# Altium schematic sheet IPMC_MACP 4.SchDoc: IPMC Driver
size A2; DrawnBy: YYH; Revision: 1.0; PageSetup: Record=PageOptions|CenterHorizontal=True|CenterVertical=True|PrintScale=0.52|XCorrection=1.00|YCorrection=1.00|PrintKind=0|BorderSize=5000000|LeftOffset=0|BottomOffset=0|Orientation=2|PaperLength=1000|PaperWidth=1000|Scale=100|PaperSource=7|PrintQuality=-3|MediaType=1|DitherType=10|PrintScaleMode=1|PaperKind=A4 210 x 297 毫米¦PaperIndex=9
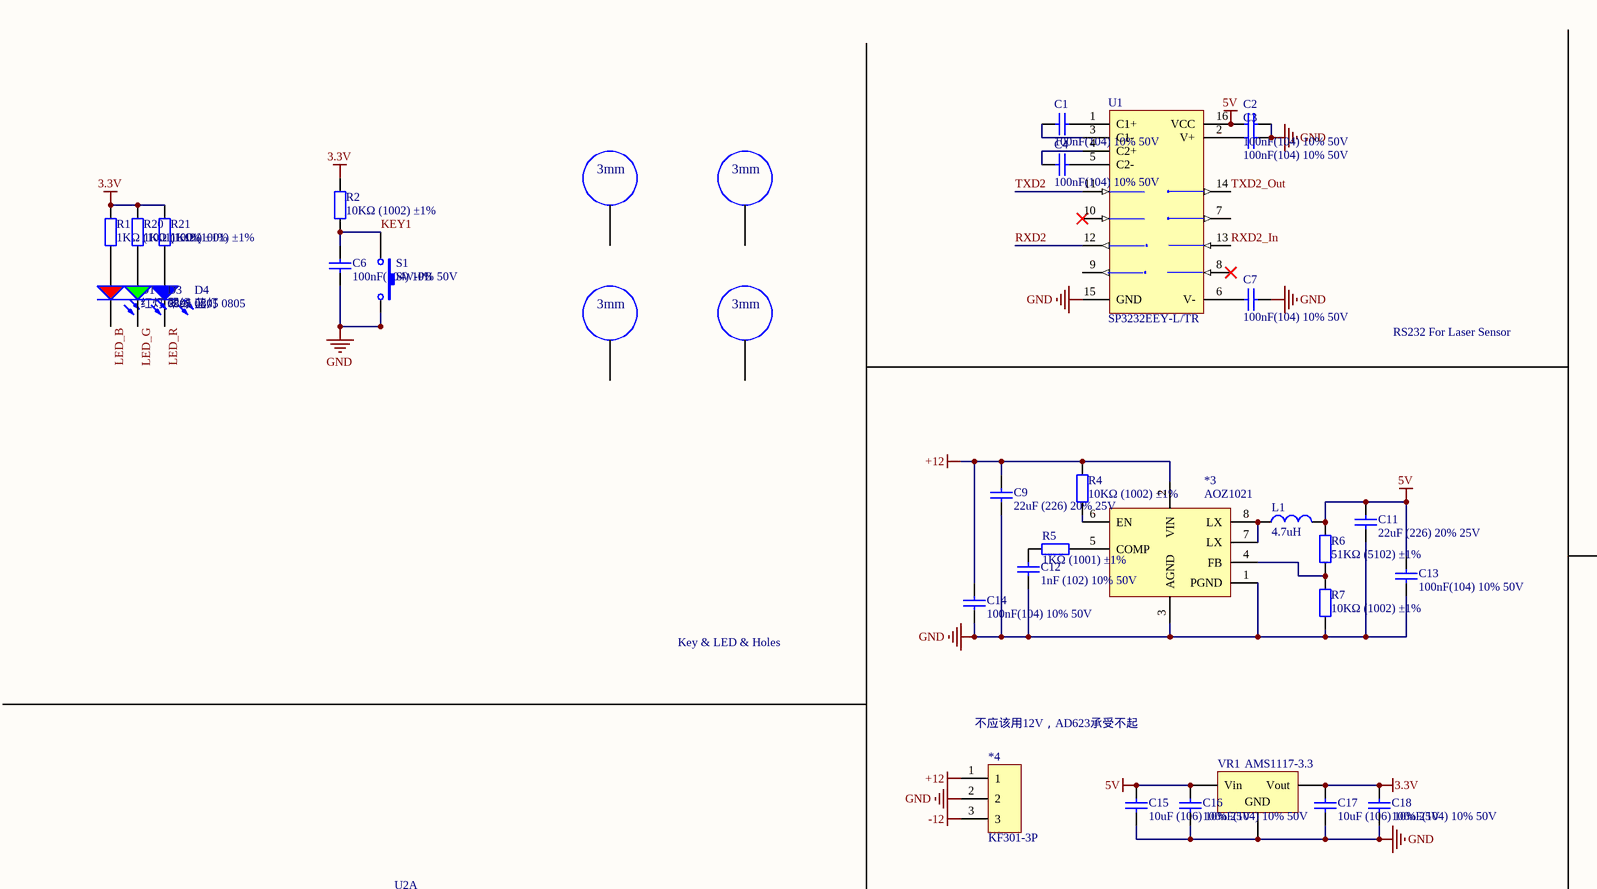
[diagram p0: IPMC_MACP 4.SchDoc, top left]
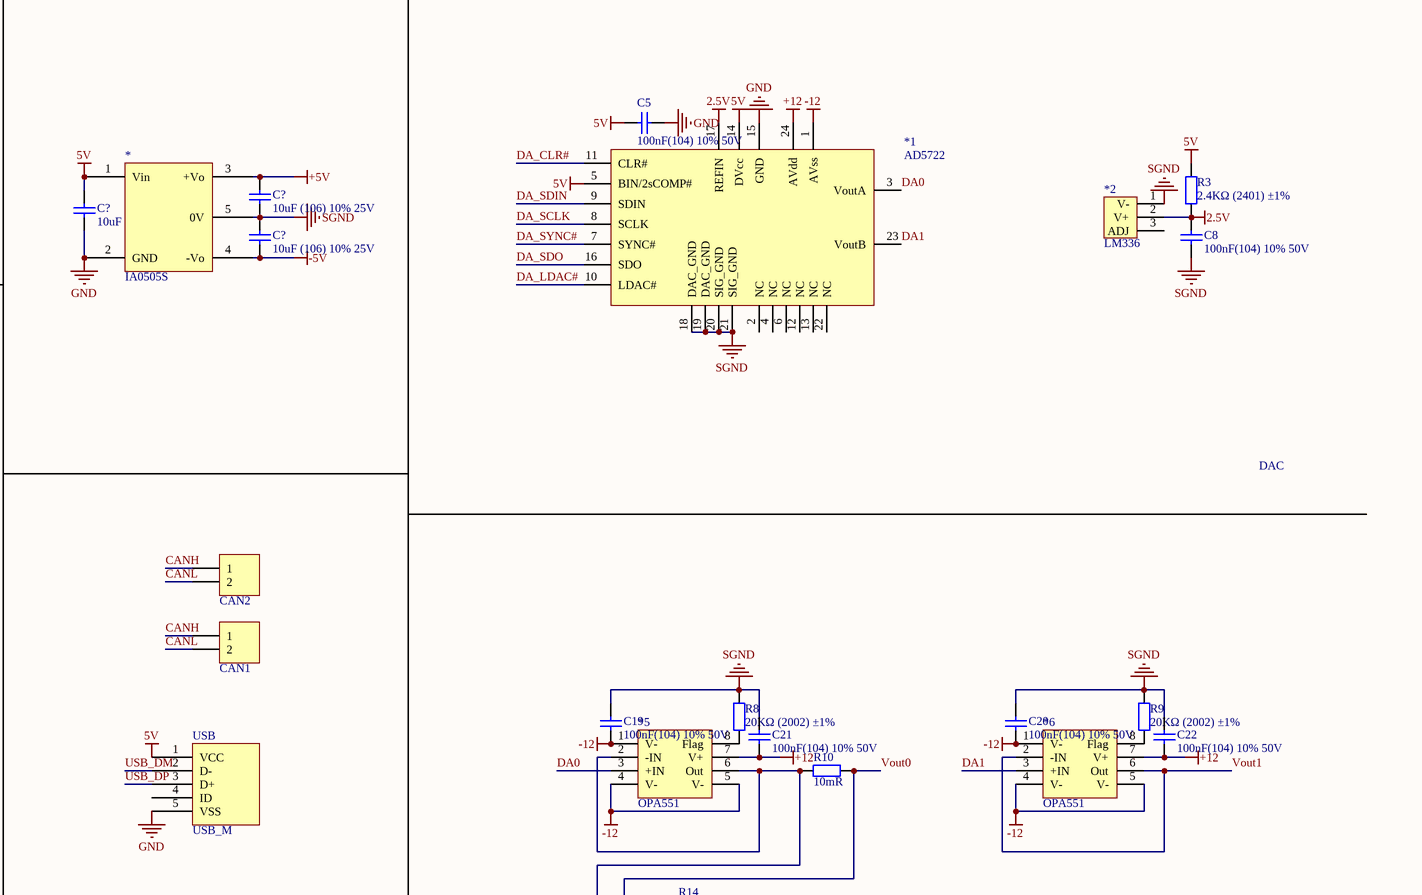
[diagram p1: IPMC_MACP 4.SchDoc, top right]
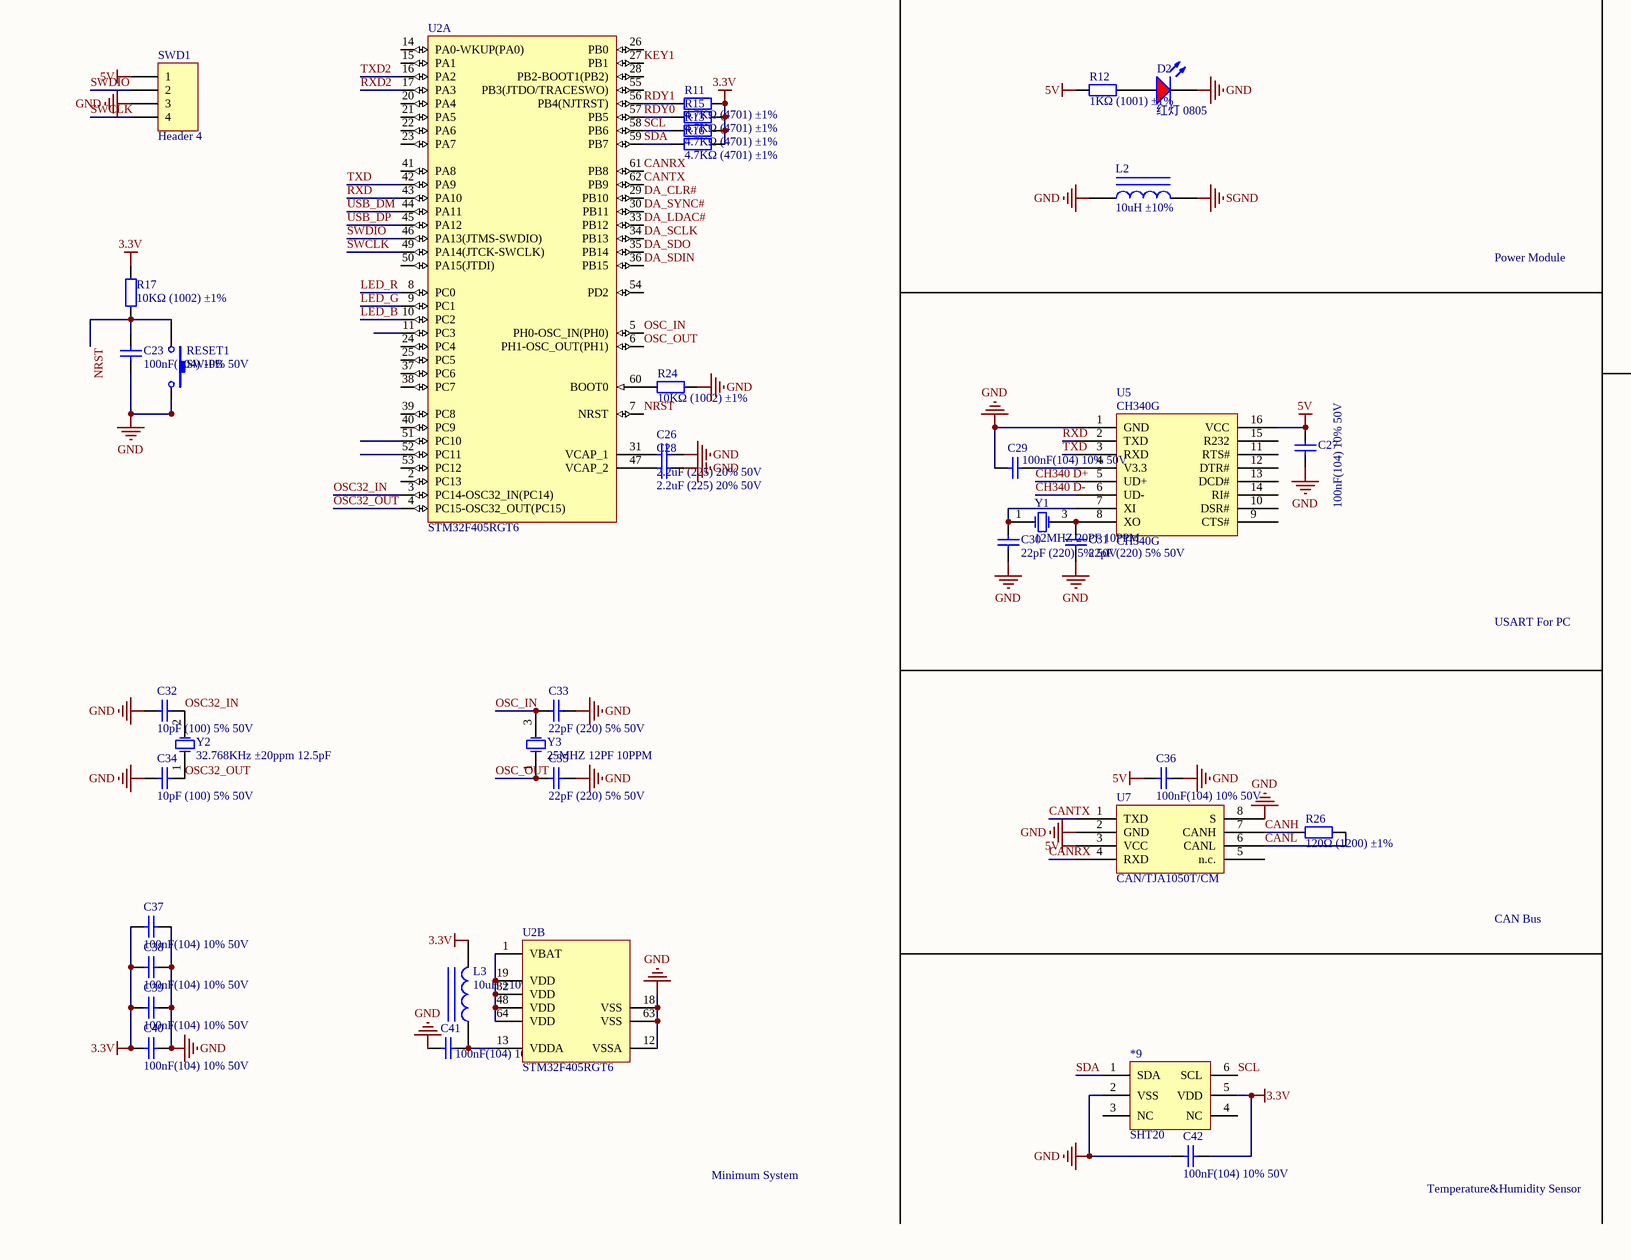
[diagram p2: IPMC_MACP 4.SchDoc, bottom left]
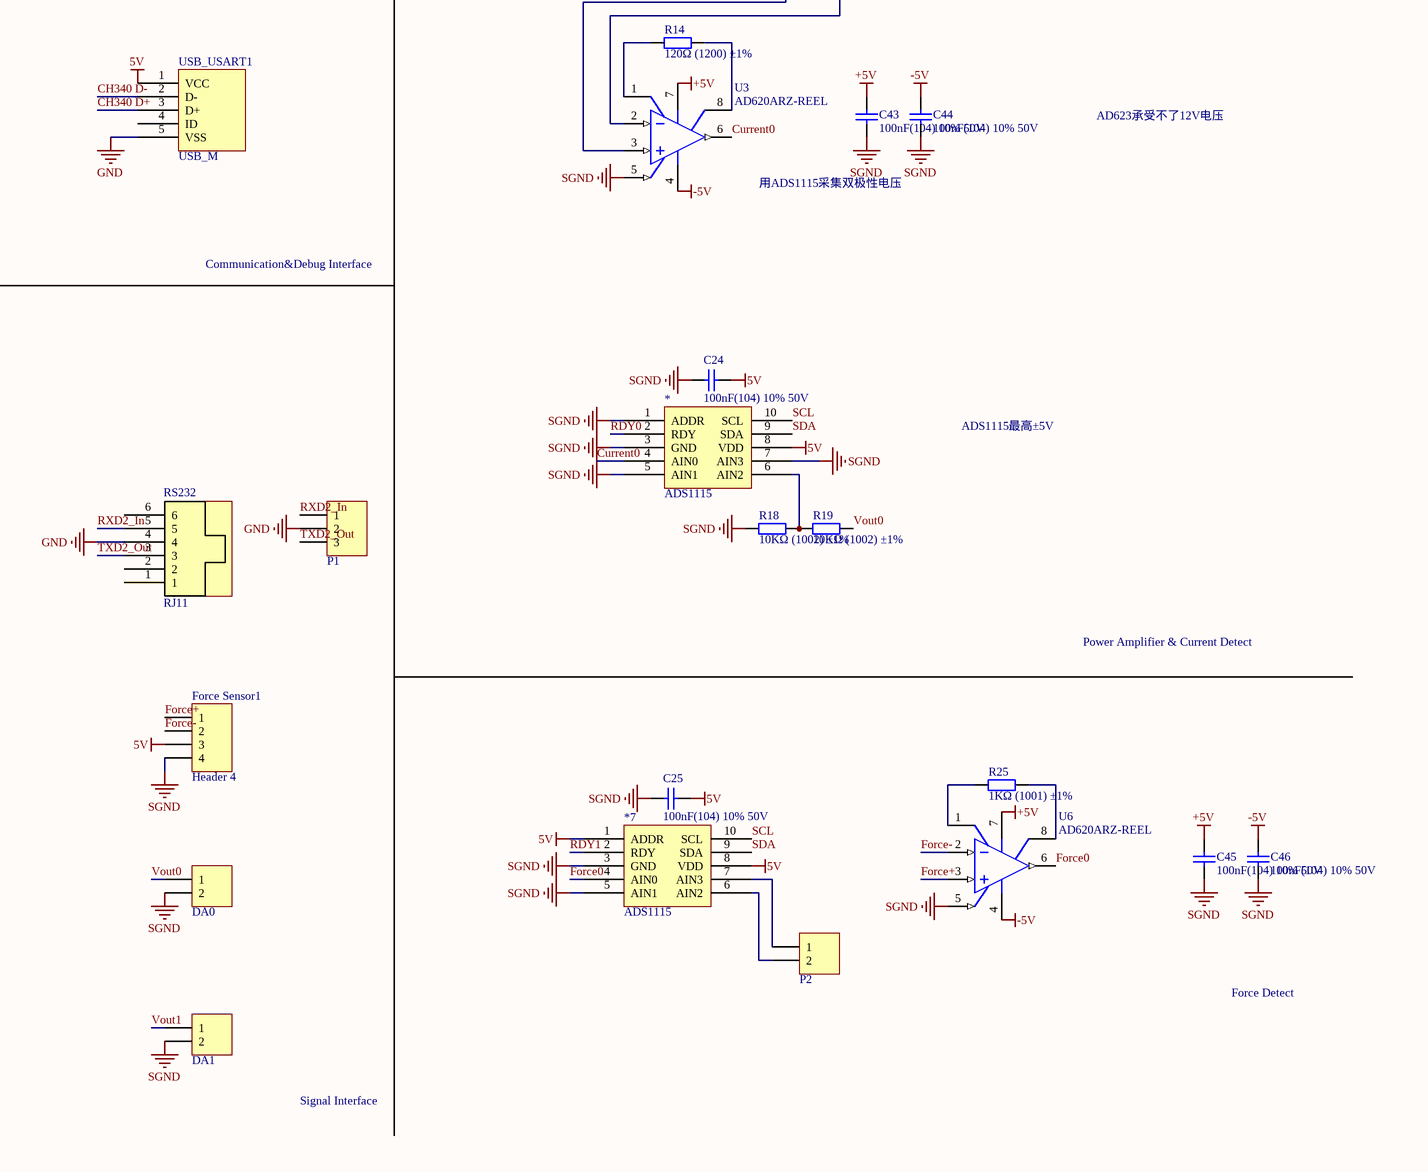
[diagram p3: IPMC_MACP 4.SchDoc, bottom right]

## Parts
(Parts that share a designator on the sheet are numbered #1, #2 ... from top to bottom, then left to right.)
*1  AD5722  [TSSOP24P]
*2  LM336  [TO-92A]
*3  AOZ1021  [SOP-8]
*4  KF301-3P  [KF301-3P]
*5  OPA551  [SOIC8_N]
*6  OPA551  [SOIC8_N]
*7  ADS1115  [MSOP-UN10_N]
*9  SHT20  [DFN6]
*#1  IA0505S  [IA0505s-B]
*#2  ADS1115  [MSOP-UN10_N]
C1  100nF(104) 10% 50V  [0805_C]
C2  100nF(104) 10% 50V  [0805_C]
C3  100nF(104) 10% 50V  [0805_C]
C4  100nF(104) 10% 50V  [0805_C]
C5  100nF(104) 10% 50V  [0805_C]
C6  100nF(104) 10% 50V  [0805_C]
C7  100nF(104) 10% 50V  [0805_C]
C8  100nF(104) 10% 50V  [0805_C]
C9  22uF (226) 20% 25V  [0805_C]
C11  22uF (226) 20% 25V  [0805_C]
C12  1nF (102) 10% 50V  [0805_C]
C13  100nF(104) 10% 50V  [0805_C]
C14  100nF(104) 10% 50V  [0805_C]
C15  10uF (106) 10% 25V  [0805_C]
C16  100nF(104) 10% 50V  [0805_C]
C17  10uF (106) 10% 25V  [0805_C]
C18  100nF(104) 10% 50V  [0805_C]
C19  100nF(104) 10% 50V  [0805_C]
C20  100nF(104) 10% 50V  [0805_C]
C21  100nF(104) 10% 50V  [0805_C]
C22  100nF(104) 10% 50V  [0805_C]
C23  100nF(104) 10% 50V  [0805_C]
C24  100nF(104) 10% 50V  [0805_C]
C25  100nF(104) 10% 50V  [0805_C]
C26  2.2uF (225) 20% 50V  [0805_C]
C27  100nF(104) 10% 50V  [0805_C]
C28  2.2uF (225) 20% 50V  [0805_C]
C29  100nF(104) 10% 50V  [0805_C]
C30  22pF (220) 5% 50V  [0805_C]
C31  22pF (220) 5% 50V  [0805_C]
C32  10pF (100) 5% 50V  [0805_C]
C33  22pF (220) 5% 50V  [0805_C]
C34  10pF (100) 5% 50V  [0805_C]
C35  22pF (220) 5% 50V  [0805_C]
C36  100nF(104) 10% 50V  [0805_C]
C37  100nF(104) 10% 50V  [0805_C]
C38  100nF(104) 10% 50V  [0805_C]
C39  100nF(104) 10% 50V  [0805_C]
C40  100nF(104) 10% 50V  [0805_C]
C41  100nF(104) 10% 50V  [0805_C]
C42  100nF(104) 10% 50V  [0805_C]
C43  100nF(104) 10% 50V  [0805_C]
C44  100nF(104) 10% 50V  [0805_C]
C45  100nF(104) 10% 50V  [0805_C]
C46  100nF(104) 10% 50V  [0805_C]
C?#1  10uF (106) 10% 25V  [0805_C]
C?#2  10uF (106) 10% 25V  [0805_C]
C?#3  10uF (106) 10% 25V  [0805_C]
CAN1  Header 2  [HDR2X1_A]  (value not drawn)
CAN2  Header 2  [HDR2X1_A]  (value not drawn)
D1  红灯 0805  [0805_LED_S1]
D2  红灯 0805  [0805_LED_S1]
D3  翠绿 0805  [0805_LED_S1]
D4  蓝灯 0805  [0805_LED_S1]
DA0  Header 2  [HDR2X1_A]  (value not drawn)
DA1  Header 2  [HDR2X1_A]  (value not drawn)
Force_Sensor1  Header 4  [HDR1X4]
L1  4.7uH  [06030]
L2  10uH ±10%  [0805_L]
L3  10uH ±10%  [0805_L]
P1  Header 3  [HDR3X1_A]  (value not drawn)
P2  Header 2  [HDR2X1_A]  (value not drawn)
R1  1KΩ (1001) ±1%  [0805_R]
R2  10KΩ (1002) ±1%  [0805_R]
R3  2.4KΩ (2401) ±1%  [0805_R]
R4  10KΩ (1002) ±1%  [0805_R]
R5  1KΩ (1001) ±1%  [0805_R]
R6  51KΩ (5102) ±1%  [0805_R]
R7  10KΩ (1002) ±1%  [0805_R]
R8  20KΩ (2002) ±1%  [0805_R]
R9  20KΩ (2002) ±1%  [0805_R]
R10  10mR  [2512]
R11  4.7KΩ (4701) ±1%  [0805_R]
R12  1KΩ (1001) ±1%  [0805_R]
R13  4.7KΩ (4701) ±1%  [0805_R]
R14  120Ω (1200) ±1%  [0805_R]
R15  4.7KΩ (4701) ±1%  [0805_R]
R16  4.7KΩ (4701) ±1%  [0805_R]
R17  10KΩ (1002) ±1%  [0805_R]
R18  10KΩ (1002) ±1%  [0805_R]
R19  10KΩ (1002) ±1%  [0805_R]
R20  1KΩ (1001) ±1%  [0805_R]
R21  1KΩ (1001) ±1%  [0805_R]
R24  10KΩ (1002) ±1%  [0805_R]
R25  1KΩ (1001) ±1%  [0805_R]
R26  120Ω (1200) ±1%  [0805_R]
RESET1  SW-PB  [SW_PB2_A1]
RS232  RJ11  [RJ6-RJ11]
S1  SW-PB  [SW_PB2_A1]
SWD1  Header 4  [HDR1X4]
T1  M3铜柱螺丝孔  [螺丝孔-3mm]  (value not drawn)
T2  M3铜柱螺丝孔  [螺丝孔-3mm]  (value not drawn)
T3  M3铜柱螺丝孔  [螺丝孔-3mm]  (value not drawn)
T4  M3铜柱螺丝孔  [螺丝孔-3mm]  (value not drawn)
U1  SP3232EEY-L/TR  [TSSOP-16]
U2  STM32F405RGT6  [STM-LQFP64_L]  (parts A,B of 2)
U3  AD620ARZ-REEL  [SOIC-8_150mil]
U5  CH340G  [SOIC-16_150mil]
U6  AD620ARZ-REEL  [SOIC-8_150mil]
U7  CAN/TJA1050T/CM  [SOIC-8_150mil]
USB  USB_M  [USB_MICRO]
USB_USART1  USB_M  [USB_MICRO]
VR1  AMS1117-3.3  [SOT-223]
Y1  12MHZ 20PF 10PPM  [SMD-3225_4P]
Y2  32.768KHz ±20ppm 12.5pF  [SMD-3215_2P FC - 135]
Y3  25MHZ 12PF 10PPM  [SMD-3225_4P]

## Nets
2.5V: *1.17(REFIN) *2.2(V+) C8.1 R3.1
3.3V: *9.5(VDD) C17.2 C18.2 C37.2 C38.2 C39.2 C40.2 C42.2 L3.2 R1.1 R2.1 R11.2 R13.2 R15.2 R16.2 R17.1 R20.1 R21.1 VR1.2(Vout)
5V: *1.5(BIN/2sCOMP#) *1.14(DVcc) *7.1(ADDR) *7.8(VDD) *#1.1(Vin) *#2.8(VDD) C2.2 C5.1 C11.2 C13.1 C15.2 C16.2 C24.2 C25.2 C27.2 C36.2 C?#2.2 Force_Sensor1.3 L1.2 R3.2 R6.2 R12.1 SWD1.1 U1.16(VCC) U5.16(VCC) U7.3(VCC) USB.1(VCC) USB_USART1.1(VCC) VR1.3(Vin)
+5V: *#1.3(+Vo) C43.2 C45.2 C?#1.2 U3.7(V+) U6.7(V+)
+12: *1.24(AVdd) *3.2(VIN) *4.1 *5.7(V+) *6.7(V+) C9.2 C14.1 C21.1 C22.1 R4.1
-5V: *#1.4(-Vo) C44.2 C46.2 C?#3.1 U3.4(V-) U6.4(V-)
-12: *1.1(AVss) *4.3 *5.1(V-) *5.4(V-) *5.5(V-) *6.1(V-) *6.4(V-) *6.5(V-) C19.1 C20.1
GND: *1.15(GND) *3.1(PGND) *3.3(AGND) *4.2 *9.2(VSS) *#1.2(GND) C2.1 C3.1 C5.2 C6.2 C7.2 C9.1 C11.1 C12.1 C13.2 C14.2 C15.1 C16.1 C17.1 C18.1 C23.2 C26.2 C27.1 C28.2 C29.2 C30.1 C31.1 C32.1 C33.1 C34.1 C35.1 C36.1 C37.1 C38.1 C39.1 C40.1 C41.1 C42.1 C?#2.1 D2.K L2.1 P1.2 R7.1 R24.2 RESET1.2 RS232.4 S1.2 SWD1.3 U1.15(GND) U2.12(VSSA) U2.18(VSS) U2.63(VSS) U5.1(GND) U7.2(GND) U7.8(S) USB.5(VSS) USB_USART1.5(VSS) VR1.1(GND)
SGND: *1.18(DAC_GND) *1.19(DAC_GND) *1.20(SIG_GND) *1.21(SIG_GND) *2.1(V-) *7.3(GND) *7.5(AIN1) *#1.5(0V) *#2.1(ADDR) *#2.3(GND) *#2.5(AIN1) *#2.7(AIN3) C8.2 C19.2 C20.2 C21.2 C22.2 C24.1 C25.1 C43.1 C44.1 C45.1 C46.1 C?#1.1 C?#3.2 DA0.2 DA1.2 Force_Sensor1.4 L2.2 R8.2 R9.2 R18.2 U3.5(REF) U6.5(REF)
CANH: CAN1.1 CAN2.1 R26.1 U7.7(CANH)
CANL: CAN1.2 CAN2.2 R26.2 U7.6(CANL)
CANRX: U2.61(PB8) U7.4(RXD)
CANTX: U2.62(PB9) U7.1(TXD)
CH340 D+: U5.5(UD+) USB_USART1.3(D+)
CH340 D-: U5.6(UD-) USB_USART1.2(D-)
Current0: *#2.4(AIN0) U3.6(OUT)
DA0: *1.3(VoutA) *5.3(+IN)
DA1: *1.23(VoutB) *6.3(+IN)
DA_CLR#: *1.11(CLR#) U2.29(PB10)
DA_LDAC#: *1.10(LDAC#) U2.33(PB12)
DA_SCLK: *1.8(SCLK) U2.34(PB13)
DA_SDIN: *1.9(SDIN) U2.36(PB15)
DA_SDO: *1.16(SDO) U2.35(PB14)
DA_SYNC#: *1.7(SYNC#) U2.30(PB11)
Force0: *7.4(AIN0) U6.6(OUT)
Force+: Force_Sensor1.1 U6.3(+IN)
Force-: Force_Sensor1.2 U6.2(-IN)
KEY1: C6.1 R2.2 S1.1 U2.27(PB1)
LED_B: D1.K U2.10(PC2)
LED_G: D3.K U2.9(PC1)
LED_R: D4.K U2.8(PC0)
NRST: C23.1 R17.2 RESET1.1 U2.7(NRST)
OSC32_IN: C32.2 U2.3(PC14-OSC32_IN(PC14)) Y2.2(OSC2)
OSC32_OUT: C34.2 U2.4(PC15-OSC32_OUT(PC15)) Y2.1(OSC1)
OSC_IN: C33.2 U2.5(PH0-OSC_IN(PH0)) Y3.3(OSC2)
OSC_OUT: C35.2 U2.6(PH1-OSC_OUT(PH1)) Y3.1(OSC1)
RDY0: *#2.2(RDY) R15.1 U2.57(PB5)
RDY1: *7.2(RDY) R11.1 U2.56(PB4(NJTRST))
RXD: U2.43(PA10) U5.2(TXD)
RXD2: U1.12(R1OUT) U2.17(PA3)
RXD2_In: P1.1 RS232.5 U1.13(R1IN)
SCL: *7.10(SCL) *9.6(SCL) *#2.10(SCL) R13.1 U2.58(PB6)
SDA: *7.9(SDA) *9.1(SDA) *#2.9(SDA) R16.1 U2.59(PB7)
SWCLK: SWD1.4 U2.49(PA14(JTCK-SWCLK))
SWDIO: SWD1.2 U2.46(PA13(JTMS-SWDIO))
TXD: U2.42(PA9) U5.3(RXD)
TXD2: U1.11(T1IN) U2.16(PA2)
TXD2_Out: P1.3 RS232.3 U1.14(T1OUT)
USB_DM: U2.44(PA11) USB.2(D-)
USB_DP: U2.45(PA12) USB.3(D+)
Vout0: DA0.1 R10.2 R19.1 U3.2(-IN)
Vout1: *6.2(-IN) *6.6(Out) DA1.1
Net*3_4: *3.4(FB) R6.1 R7.2
Net*3_5: *3.5(COMP) R5.1
Net*3_6: *3.6(EN) R4.2
Net*3_7: *3.7(LX) *3.8(LX) L1.1
Net*5_2: *5.2(-IN) *5.6(Out) R10.1 U3.3(+IN)
Net*5_8: *5.8(Flag) R8.1
Net*6_8: *6.8(Flag) R9.1
Net*7_6: *7.6(AIN2) P2.2
Net*7_7: *7.7(AIN3) P2.1
Net*#2_6: *#2.6(AIN2) R18.1 R19.2
NetC1_1: C1.1 U1.3(C1-)
NetC1_2: C1.2 U1.1(C1+)
NetC3_2: C3.2 U1.2(V+)
NetC4_1: C4.1 U1.4(C2+)
NetC4_2: C4.2 U1.5(C2-)
NetC7_1: C7.1 U1.6(V-)
NetC12_2: C12.2 R5.2
NetC26_1: C26.1 U2.31(VCAP_1)
NetC28_1: C28.1 U2.47(VCAP_2)
NetC29_1: C29.1 U5.4(V3.3)
NetC30_2: C30.2 U5.7(XI) Y1.1(OSC1)
NetC31_2: C31.2 U5.8(XO) Y1.3(OSC2)
NetC41_2: C41.2 L3.1 U2.13(VDDA)
NetD1_A: D1.A R1.2
NetD2_A: D2.A R12.2
NetD3_A: D3.A R20.2
NetD4_A: D4.A R21.2
NetR14_1: R14.1 U3.1(RG)
NetR14_2: R14.2 U3.8(RG)
NetR24_1: R24.1 U2.60(BOOT0)
NetR25_1: R25.1 U6.1(RG)
NetR25_2: R25.2 U6.8(RG)
NetU2_1: U2.1(VBAT) U2.19(VDD) U2.32(VDD) U2.48(VDD) U2.64(VDD)

Not connected (* = marked no-connect by the designer): *1 2(NC) 4(NC) 6(NC) 12(NC) 13(NC) 22(NC); *2 3(ADJ); *9 3(NC) 4(NC); RS232 1 2 6; T1 1; T2 1; T3 1; T4 1; U1 7(T2OUT) 8(R2IN)* 9(R2OUT) 10(T2IN)*; U2 2(PC13) 11(PC3) 14(PA0-WKUP(PA0)) 15(PA1) 20(PA4) 21(PA5) 22(PA6) 23(PA7) 24(PC4) 25(PC5) 26(PB0) 28(PB2-BOOT1(PB2)) 37(PC6) 38(PC7) 39(PC8) 40(PC9) 41(PA8) 50(PA15(JTDI)) 51(PC10) 52(PC11) 53(PC12) 54(PD2) 55(PB3(JTDO/TRACESWO)); U5 9(CTS#) 10(DSR#) 11(RTS#) 12(DTR#) 13(DCD#) 14(RI#) 15(R232); U7 5(n.c.); USB 4(ID); USB_USART1 4(ID)

## Notes on the sheet
- RS232 For Laser Sensor
- DAC
- Key & LED & Holes
- (near *4) 不应该用12V，AD623承受不起
- AD623承受不了12V电压
- Power Module
- 用ADS1115采集双极性电压
- Communication&Debug Interface
- ADS1115最高±5V
- USART For PC
- Power Amplifier & Current Detect
- CAN Bus
- Force Detect
- Minimum System
- Temperature&Humidity Sensor
- Signal Interface
- (in symbol M3铜柱螺丝孔) 3mm

## Library data of the parts
*1 = AD5722: 双极性DAC
*2 = LM336: 基准电压芯片2.5/5V
*3 = AOZ1021: 3A开关电源芯片
*4 = KF301-3P: 蓝色端子
*5 *6 = OPA551: 高电压大电流运算放大器
C1-C8 C13 C14 C16 C18-C25 C27 C29 C36-C46 = 0805 100nF(104) 10% 50V: 贴片电容; ComponentLink1Description: 供应商链接; ComponentLink1URL: http://www.szlcsc.com/product/details_50686.html; Package: 0805; Supplier: LC; SuppliersPartNumber: C49678
C9 C11 = 0805 22uF (226) 20% 25V: 贴片电容; ComponentLink1Description: 供应商链接; ComponentLink1URL: http://www.szlcsc.com/product/details_46786.html; Package: 0805; Supplier: LC; SuppliersPartNumber: C45783
C12 = 0805 1nF (102) 10% 50V: 贴片电容; ComponentLink1Description: 供应商链接; ComponentLink1URL: http://www.szlcsc.com/product/details_52223.html; Package: 0805; Supplier: LC; SuppliersPartNumber: C51210
C15 C17 C?#1-C?#3 = 0805 10uF (106) 10% 25V: 贴片电容; ComponentLink1Description: 供应商链接; ComponentLink1URL: http://www.szlcsc.com/product/details_16532.html; Package: 0805; Supplier: LC; SuppliersPartNumber: C15850
C26 C28 = 0805 2.2uF (225) 20% 50V: 贴片电容; ComponentLink1Description: 供应商链接; ComponentLink1URL: http://www.szlcsc.com/product/details_50225.html; Package: 0805; Supplier: LC; SuppliersPartNumber: C49217
C30 C31 C33 C35 = 0805 22pF (220) 5% 50V: 贴片电容; ComponentLink1Description: 供应商链接; ComponentLink1URL: http://www.szlcsc.com/product/details_2156.html; Package: 0805; Supplier: LC; SuppliersPartNumber: C1804
C32 C34 = 0805 10pF (100) 5% 50V: 贴片电容; ComponentLink1Description: 供应商链接; ComponentLink1URL: http://www.szlcsc.com/product/details_2137.html; Package: 0805; Supplier: LC; SuppliersPartNumber: C1785
CAN1 CAN2 DA0 DA1 P2 = Header 2: 接插件; LatestRevisionDate: 17-Jul-2002; LatestRevisionNote: Re-released for DXP Platform.; Publisher: Altium Limited
D1 D2 = 0805 红灯: 发光二极管; ComponentLink1Description: 供应商链接; ComponentLink1URL: http://www.szlcsc.com/product/details_2668.html; Package: 0805; Supplier: LC; SuppliersPartNumber: C2295
D3 = 0805 翠绿: 发光二极管; ComponentLink1Description: 供应商链接; ComponentLink1URL: http://www.szlcsc.com/product/details_2670.html; Package: 0805; Supplier: LC; SuppliersPartNumber: C2297
D4 = 0805 蓝灯: 发光二极管; ComponentLink1Description: 供应商链接; ComponentLink1URL: http://www.szlcsc.com/product/details_2666.html; Package: 0805; Supplier: LC; SuppliersPartNumber: C2293
Force_Sensor1 SWD1 = Header 4: Header, 4-Pin; LatestRevisionDate: 17-Jul-2002; LatestRevisionNote: Re-released for DXP Platform.; Publisher: Altium Limited
L1 = Inductor: 电感; Code_IEC: 1005; Published: 8-Jun-2000; LatestRevisionDate: 17-Jul-2002; LatestRevisionNote: Re-released for DXP Platform.; PackageReference: 0402-A; Publisher: Altium Limited; Code_JEITA: 0402
L2 L3 = 0805 10uH 10%: 贴片电感; ComponentLink1Description: 供应商链接; ComponentLink1URL: http://www.szlcsc.com/product/details_1398.html; Package: 0805; Supplier: LC; SuppliersPartNumber: C1046
P1 = Header 3: 接插件; LatestRevisionDate: 17-Jul-2002; LatestRevisionNote: Re-released for DXP Platform.; Publisher: Altium Limited
R1 R5 R12 R20 R21 R25 = 0805 1KΩ (1001) 1%: 贴片电阻; ComponentLink1Description: 供应商链接; ComponentLink1URL: http://www.szlcsc.com/product/details_18201.html; Package: 0805; Supplier: LC; SuppliersPartNumber: C17513
R2 R4 R7 R17-R19 R24 = 0805 10KΩ (1002) 1%: 贴片电阻; ComponentLink1Description: 供应商链接; ComponentLink1URL: http://www.szlcsc.com/product/details_18102.html; Package: 0805; Supplier: LC; SuppliersPartNumber: C17414
R3 = 0805 2.4KΩ (2401) 1%: 贴片电阻; ComponentLink1Description: 供应商链接; ComponentLink1URL: http://www.szlcsc.com/product/details_18214.html; Package: 0805; Supplier: LC; SuppliersPartNumber: C17526
R6 = 0805 51KΩ (5102) 1%: 贴片电阻; ComponentLink1Description: 供应商链接; ComponentLink1URL: http://www.szlcsc.com/product/details_18425.html; Package: 0805; Supplier: LC; SuppliersPartNumber: C17737
R8 R9 = 0805 20KΩ (2002) 1%: 贴片电阻; ComponentLink1Description: 供应商链接; ComponentLink1URL: http://www.szlcsc.com/product/details_4735.html; Package: 0805; Supplier: LC; SuppliersPartNumber: C4328
R10 = Res1: 贴片电阻; Published: 8-Jun-2000; LatestRevisionDate: 17-Jul-2002; LatestRevisionNote: Re-released for DXP Platform.; PackageReference: AXIAL-0.4; Publisher: Altium Limited
R11 R13 R15 R16 = 0805 4.7KΩ (4701) 1%: 贴片电阻; ComponentLink1Description: 供应商链接; ComponentLink1URL: http://www.szlcsc.com/product/details_18361.html; Package: 0805; Supplier: LC; SuppliersPartNumber: C17673
R14 R26 = 0805 120Ω (1200) 1%: 贴片电阻; ComponentLink1Description: 供应商链接; ComponentLink1URL: http://www.szlcsc.com/product/details_18125.html; Package: 0805; Supplier: LC; SuppliersPartNumber: C17437
RESET1 S1 = SW-PB: 微动开关; Published: 24-Mar-1999; LatestRevisionDate: 17-Jul-2002; LatestRevisionNote: Re-released for DXP Platform.; PackageReference: SPST-2; Publisher: Altium Limited
U1 = SP3232EEY-L/TR: RS232; ComponentLink1Description: 供应商链接; ComponentLink1URL: http://www.szlcsc.com/product/details_14131.html; Package: TSSOP-16; Supplier: LC; SuppliersPartNumber: C13482
U2 = STM32F405RGT6: ARM Cortex-M4 32-bit MCU+FPU, 210 DMIPS, 1024 kB Flash, 192 kB Internal RAM, 51 I/Os, 64-pin LQFP, -40 to 85 degC, Tray; Manufacturer: STMicroelectronics; D/A Converter: 2x12-bit; FLASH Size (Prog) (kB): 1024; I/Os (High Current): 51; Internal RAM Size (kB): 192; Operating Frequency(F) (Processor speed) (MHz): 168; Supply Voltage(Vcc) max (V): 3.6; Supply Voltage(Vcc) min (V): 1.8; DatasheetVersion: Rev. 4; PackageVersion: Rev. 4, 06/2013; PackageReference: LQFP64; PackageDescription: 64-Pin Low Profile Quad Flat Package, 10 x 10 mm Body, 0.5 mm Pitch; Supplier 1: Digi-Key; Supplier Part Number 1: 497-11767-ND; Supplier 2: Farnell; Supplier Part Number 2: 2064363; Supplier 3: Newark; Supplier Part Number 3: 73T2329; Supplier 4: Mouser; Supplier Part Number 4: 511-STM32F405RGT6; Core: ARM Cortex-M4; Packing: Tray; Mounting Technology: Surface Mount; PartNumber: STM32F405RGT6; ComponentLink1Description: Manufacturer URL; ComponentLink1URL: http://www.st.com/web/en/home.html; ComponentLink2Description: Datasheet; ComponentLink2URL: http://www.st.com/st-web-ui/static/active/en/resource/technical/document/datasheet/DM00037051.pdf; ComponentLink3Description: Package Specification; ComponentLink3URL: http://www.st.com/st-web-ui/static/active/en/resource/technical/document/datasheet/DM00037051.pdf
U3 U6 = AD620ARZ-REEL: 仪放; ComponentLink1Description: 供应商链接; ComponentLink1URL: http://www.szlcsc.com/product/details_10205.html; Package: SOIC-8_150mil; Supplier: LC; SuppliersPartNumber: C9675
U5 = CH340G: USB; ComponentLink1Description: 供应商链接; ComponentLink1URL: http://www.szlcsc.com/product/details_14927.html; Package: SOIC-16_150mil; Supplier: LC; SuppliersPartNumber: C14267
U7 = CAN/TJA1050T/CM: CAN; ComponentLink1Description: 供应商链接; ComponentLink1URL: http://www.szlcsc.com/product/details_7424.html; Package: SOIC-8_150mil; Supplier: LC; SuppliersPartNumber: C6952
USB USB_USART1 = USB_M: MicroUSB接口
VR1 = SOT-223 AMS1117-3.3: 低压差线性稳压(LDO); ComponentLink1Description: 供应商链接; ComponentLink1URL: http://www.szlcsc.com/product/details_6652.html; Package: SOT-223; Supplier: LC; SuppliersPartNumber: C6186
Y1 = SMD-3225_4P  12MHZ 20PF 10PPM: 贴片晶振; ComponentLink1Description: 供应商链接; ComponentLink1URL: http://www.szlcsc.com/product/details_9522.html; Package: SMD-3225_4P; Supplier: LC; SuppliersPartNumber: C9002
Y2 = SMD-3215_2P 32.768KHz 20ppm 12.5pF: 贴片晶振; ComponentLink1Description: 供应商链接; ComponentLink1URL: http://www.szlcsc.com/product/details_33310.html; Package: SMD-3215_2P; Supplier: LC; SuppliersPartNumber: C32346
Y3 = SMD-3225_4P  25MHZ 12PF 10PPM: 贴片晶振; ComponentLink1Description: 供应商链接; ComponentLink1URL: http://www.szlcsc.com/product/details_9526.html; Package: SMD-3225_4P; Supplier: LC; SuppliersPartNumber: C9006